# Altium schematic sheet 07_HDMI.SchDoc
size A4
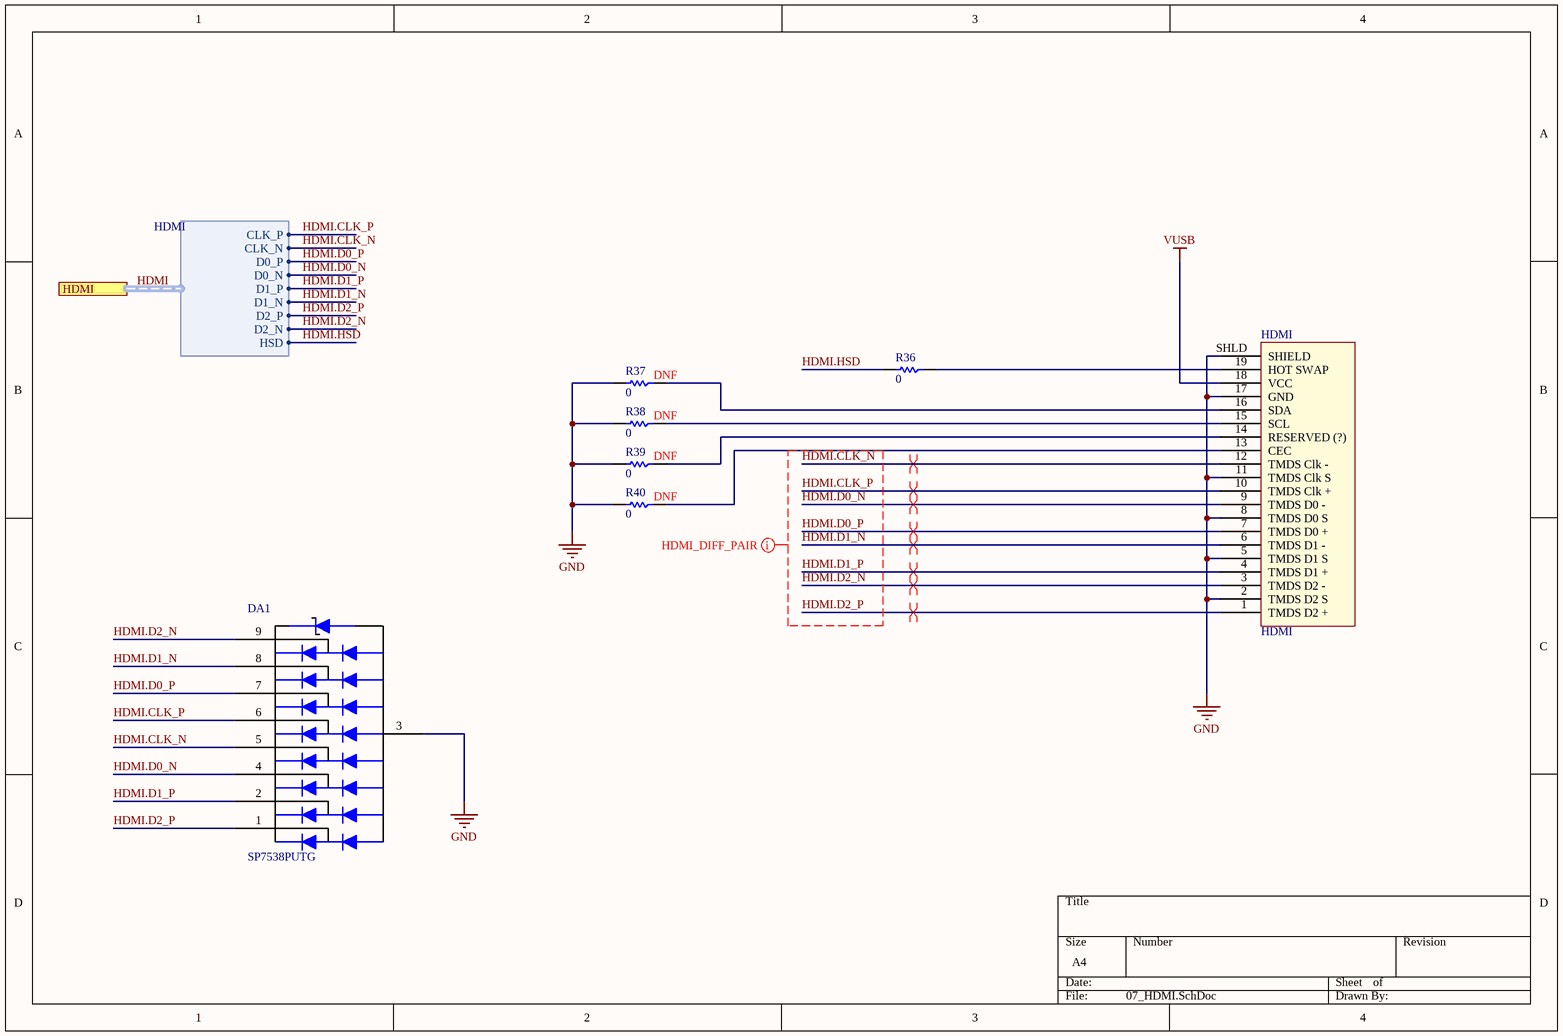
[diagram p0: 07_HDMI.SchDoc]

## Parts
DA1  SP7538PUTG  [9-UDFN]
HDMI  HDMI  [HDMI]
R36  0  [RES0402R]
R37  Load: DNF  [RES0402R]  (hidden comment: 0)
R38  Load: DNF  [RES0402R]  (hidden comment: 0)
R39  Load: DNF  [RES0402R]  (hidden comment: 0)
R40  Load: DNF  [RES0402R]  (hidden comment: 0)

## Ports
HDMI (harness HDMI)

## Harnesses
HDMI: CLK_P, CLK_N, D0_P, D0_N, D1_P, D1_N, D2_P, D2_N, HSD

## Nets
GND: DA1.3 HDMI.2(TMDS_D2_S) HDMI.5(TMDS_D1_S) HDMI.8(TMDS_D0_S) HDMI.11(TMDS_Clk_S) HDMI.17(GND) HDMI.SHLD(SHIELD) R37.2 R38.2 R39.2 R40.2
VUSB: HDMI.18(VCC)
HDMI.CLK_N: DA1.5 HDMI.12(TMDS_Clk_-) ; port HDMI.CLK_N
HDMI.CLK_P: DA1.6 HDMI.10(TMDS_Clk_+) ; port HDMI.CLK_P
HDMI.D0_N: DA1.4 HDMI.9(TMDS_D0_-) ; port HDMI.D0_N
HDMI.D0_P: DA1.7 HDMI.7(TMDS_D0_+) ; port HDMI.D0_P
HDMI.D1_N: DA1.8 HDMI.6(TMDS_D1_-) ; port HDMI.D1_N
HDMI.D1_P: DA1.2 HDMI.4(TMDS_D1_+) ; port HDMI.D1_P
HDMI.D2_N: DA1.9 HDMI.3(TMDS_D2_-) ; port HDMI.D2_N
HDMI.D2_P: DA1.1 HDMI.1(TMDS_D2_+) ; port HDMI.D2_P
HDMI.HSD: R36.2 ; port HDMI.HSD
NetHDMI_13: HDMI.13(CEC) R40.1
NetHDMI_14: HDMI.14(RESERVED_(?)) R39.1
NetHDMI_15: HDMI.15(SCL) R38.1
NetHDMI_16: HDMI.16(SDA) R37.1
NetHDMI_19: HDMI.19(HOT_SWAP) R36.1

## Buses and harness runs
harness HDMI = port HDMI

## Layout directives
differential pair: HDMI.CLK_N, HDMI.CLK_P, HDMI.D0_N, HDMI.D0_P, HDMI.D1_N, HDMI.D1_P, HDMI.D2_N, HDMI.D2_P
net class HDMI_Diff_pair: HDMI.CLK_N, HDMI.CLK_P, HDMI.D0_N, HDMI.D0_P, HDMI.D1_N, HDMI.D1_P, HDMI.D2_N, HDMI.D2_P

## Library data of the parts
DA1 = TVS ARRAY: Littelfuse Inc. SP7538PUTG; 01 Created By: Thomas Harper (12/03/2017); 02 Reviewed By: Rodrigo Maureira @ 2018-04-06; Load: YES; Published: 12-Mar-2018; Publisher: MUEEC; Supplier 1: Digi-Key; Supplier Part Number 1: F7417CT-ND; Mount: SMD
HDMI = HDMI: 19 Pin HDMI; 01 Created By: Thomas Harper @ 2018-03-12; 02 Reviewed By: Rodrigo Maureira @ 2018-04-06; Class I: Connector; Load: YES; Published: 12-Mar-2018; Publisher: MUEEC; Supplier 1: Digi-Key; Supplier Part Number 1: 609-4614-1-ND; Mount: SMD
R36 = R: Resistor; Load: YES; Mount: SMD; Supplier 1: Digi-Key; Supplier Part Number 1: 311-0.0LRCT-ND; Value: 0
R37-R40 = R: Resistor; Mount: SMD; Supplier 1: Digi-Key; Supplier Part Number 1: 311-0.0LRCT-ND; Value: 0